# EAGLE schematic HW1_Micro2 (EAGLE 7.6.0)
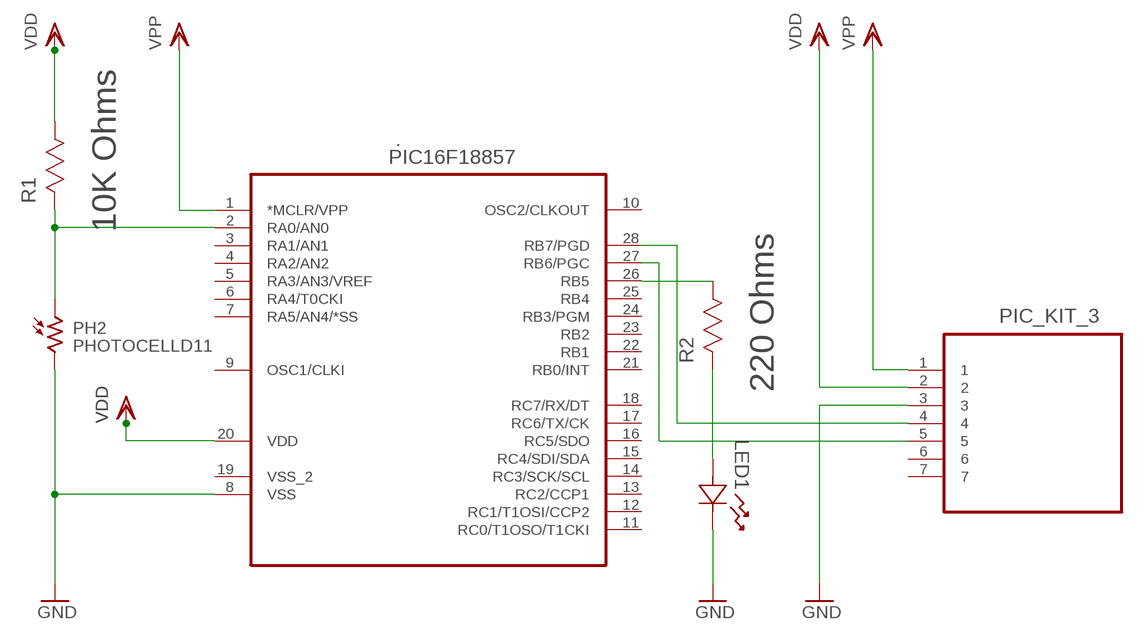
[diagram p0: schematic, sheet 1]

## Parts
.  PIC16F18857  PIC16LF76-I/SP  [DIP254P724X406-28]
LED1  CMD17-21VYC_TR8  [LED_CMD17-21VYC_TR8]
PH2  PHOTOCELLD11  [D11XX_H]
PIC_KIT_3  TLW-107-06-T-S  [SAMTEC_TLW-107-06-T-S]
R1  10K Ohms  CRCW060312K4FKEA  [RESC1608X60N]
R2  220 Ohms  CRCW060312K4FKEA  [RESC1608X60N]

## Nets
GND: ..8(VSS) LED1.2 PH2.2 PIC_KIT_3.3
N$1: ..2(RA0/AN0) PH2.1 R1.2
N$2: ..28(RB7/PGD) PIC_KIT_3.4
N$3: ..26(RB5) R2.1
N$4: LED1.1 R2.2
N$5: ..27(RB6/PGC) PIC_KIT_3.5
VDD: ..1(*MCLR/VPP) ..20(VDD) PIC_KIT_3.1 PIC_KIT_3.2 R1.1 ; supply symbol labelled VPP
Unconnected: ..3(RA1/AN1) ..4(RA2/AN2) ..5(RA3/AN3/VREF) ..6(RA4/T0CKI) ..7(RA5/AN4/*SS) ..9(OSC1/CLKI) ..10(OSC2/CLKOUT) ..11(RC0/T1OSO/T1CKI) ..12(RC1/T1OSI/CCP2) ..13(RC2/CCP1) ..14(RC3/SCK/SCL) ..15(RC4/SDI/SDA) ..16(RC5/SDO) ..17(RC6/TX/CK) ..18(RC7/RX/DT) ..19(VSS_2) ..21(RB0/INT) ..22(RB1) ..23(RB2) ..24(RB3/PGM) ..25(RB4) PIC_KIT_3.6 PIC_KIT_3.7

## Library data of the parts
. = Microchip_By_element14_Batch_1:PIC16LF76-I/SP: IC PIC MCU FLASH 8KX14; MPN: PIC16LF76-I/SP; OC_FARNELL: 9761640; OC_NEWARK: 97K7479; PACKAGE: 28-DIP; SUPPLIER: Microchip
LED1 = Chicago Miniature Lighting_By_element14_Batch_1:CMD17-21VYC_TR8: LED, YELLOW, 12MCD, 585NM; LEDCOLOR: YELLOW; MPN: CMD17-21VYC_TR8; OC_FARNELL: -; OC_NEWARK: 34C8665; PACKAGE: 2 -PIN LED; SUPPLIER: CHICAGO MINIATURE LIGHTING
PH2 = photo-elements:PHOTOCELL: Photo Sensor
PIC_KIT_3 = SAMTEC-Txx_By_element14_Batch_1:TLW-107-06-T-S: CONNECTOR HEADER, 7 WAY, 1ROW; MPN: TLW-107-06-T-S; OC_FARNELL: -; OC_NEWARK: 12P0419; PACKAGE: CONN HEADER 7 POS .100 inch; SUPPLIER: SAMTEC
R1 R2 = Vishay_By_element14_Batch_1:CRCW060312K4FKEA: RESISTOR, 0603; MPN: CRCW060312K4FKEA; OC_FARNELL: 1652836; OC_NEWARK: 52K8106; SUPPLIER: Vishay; TOLERANCE: ± 1.0 %; VALUE: 12.4K Ohms; WATTAGE: 0.1W